# Altium schematic sheet main.SchDoc
size A; SheetNumber: 1; SheetTotal: 1; SPICEModelCacheUAJBMRTG: <root> / <DocumentId>UAJBMRTG</DocumentId> / <CacheFrame Number="0"> / <Model Name="dpsw8" Kind="CKT"> / <Text>* DIP switch 8 / * jjt 20/6/2002: created / * / *             Switch connections: / *             sw1 / *             |  |  sw2 / *             |  |  |  |  sw3 / *             |  |  |  |  |  |   sw4 / *             |  |  |  |  |  |  |   |    sw5 / *             |  |  |  |  |  |  |   |   |   |    sw6 / *             |  |  |  |  |  |  |   |   |   |   |   |    sw7 / *             |  |  |  |  |  |  |   |   |   |   |   |   |   |    sw8 / *             |  |  |  |  |  |  |   |   |   |   |   |   |   |   |   | / *             |  |  |  |  |  |  |   |   |   |   |   |   |   |   |   | / .subckt dpsw8 1  2  4  5  7  8  10  11  13  14  16  17  19  20  22  23 / + PARAMS: STATE1=0 STATE2=0 STATE3=0 STATE4=0 STATE5=0 STATE6=0 STATE7=0 STATE8=0 RON=1m ROFF=100E6 / * / V1 3  0 {STATE1} / V2 6  0 {STATE2} / V3 9  0 {STATE3} / V4 12 0 {STATE4} / V5 15 0 {STATE5} / V6 18 0 {STATE6} / V7 21 0 {STATE7} / V8 24 0 {STATE8} / * / SDIP1 1  2  3  0 DIPMOD / SDIP2 4  5  6  0 DIPMOD / SDIP3 7  8  9  0 DIPMOD / SDIP4 10 11 12 0 DIPMOD / SDIP5 13 14 15 0 DIPMOD / SDIP6 16 17 18 0 DIPMOD / SDIP7 19 20 21 0 DIPMOD / SDIP8 22 23 24 0 DIPMOD / * / .MODEL DIPMOD SW(VT=0.5 RON={RON} ROFF={ROFF}) / .ends dpsw8</Text> / </Model> / </CacheFrame> / </root>
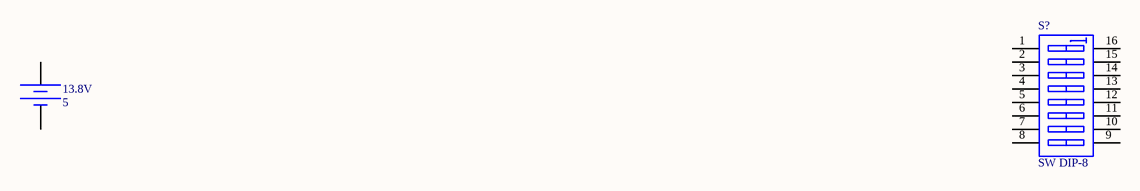
[diagram p0: main.SchDoc]

## Parts
13.8V  DC Magnitude: 5  (hidden comment: Constant Voltage Source)
S?  SW DIP-8  [DIP_SW_8WAY_SMD]

## Nets

Not connected (* = marked no-connect by the designer): 13.8V 1 2; S? 1(A1) 2(A2) 3(A3) 4(A4) 5(A5) 6(A6) 7(A7) 8(A8) 9(B8) 10(B7) 11(B6) 12(B5) 13(B4) 14(B3) 15(B2) 16(B1)

## Library data of the parts
13.8V = Battery: SimulationGenericComponent: True
S? = SW DIP-8: DIP Switch, 8 Position, SPST; Published: 24-Mar-1999; LatestRevisionDate: 17-Jul-2002; LatestRevisionNote: Re-released for DXP Platform.; PackageReference: DIP_SW_8WAY_SMD; Publisher: Altium Limited; PackageDescription: DIP Switch; 16 Leads